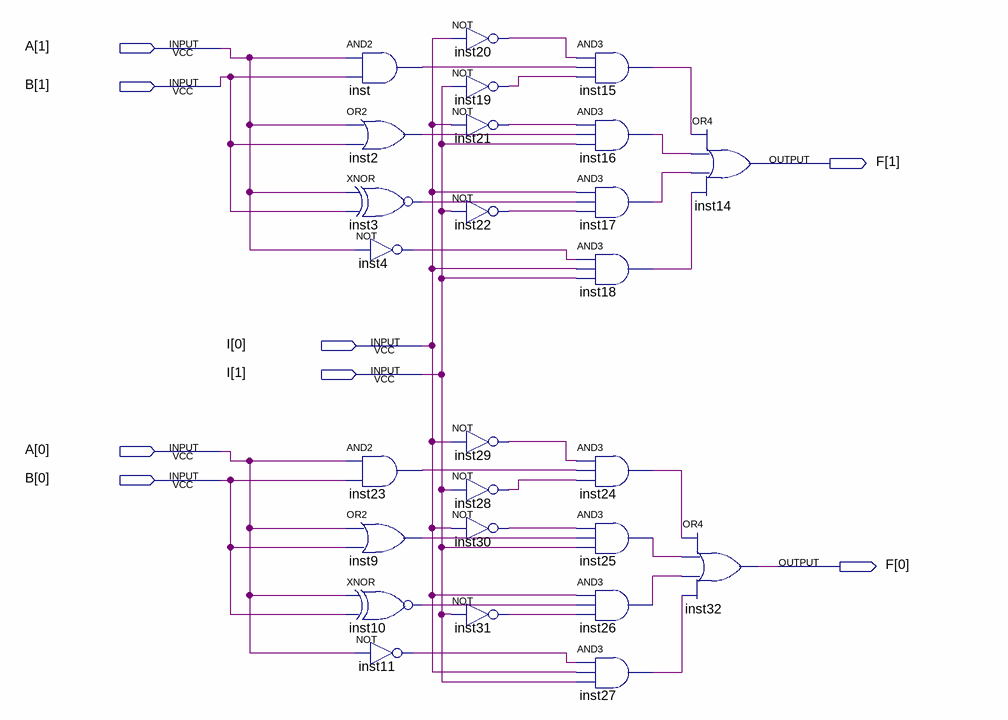
[diagram p0: schematic sheet]
// Quartus schematic TinyTechSchem.bdf as structural Verilog: 26 symbols, 8 pins
module TinyTechSchem (
  input  [1:0] A,
  input  [1:0] B,
  input  [1:0] I,
  output [1:0] F
);

  wire inst2_out, inst3_out, inst4_out, inst9_out, inst10_out, inst11_out, inst15_out, inst16_out,
       inst17_out, inst18_out, inst19_out, inst20_out, inst21_out, inst22_out, inst23_out, inst24_out,
       inst25_out, inst26_out, inst27_out, inst28_out, inst29_out, inst30_out, inst31_out, inst_out;

  and inst (inst_out, A[1], B[1]);
  or inst2 (inst2_out, A[1], B[1]);
  xnor inst3 (inst3_out, A[1], B[1]);
  not inst4 (inst4_out, A[1]);
  and inst23 (inst23_out, A[0], B[0]);
  or inst9 (inst9_out, A[0], B[0]);
  xnor inst10 (inst10_out, A[0], B[0]);
  not inst11 (inst11_out, A[0]);
  not inst20 (inst20_out, I[0]);
  not inst19 (inst19_out, I[1]);
  not inst21 (inst21_out, I[0]);
  not inst22 (inst22_out, I[1]);
  not inst29 (inst29_out, I[0]);
  not inst28 (inst28_out, I[1]);
  not inst30 (inst30_out, I[0]);
  not inst31 (inst31_out, I[1]);
  and inst15 (inst15_out, inst20_out, inst_out, inst19_out);
  and inst16 (inst16_out, inst21_out, inst2_out, I[1]);
  and inst17 (inst17_out, I[0], inst3_out, inst22_out);
  and inst18 (inst18_out, inst4_out, I[0], I[1]);
  and inst24 (inst24_out, inst29_out, inst23_out, inst28_out);
  and inst25 (inst25_out, inst30_out, inst9_out, I[1]);
  and inst26 (inst26_out, I[0], inst10_out, inst31_out);
  and inst27 (inst27_out, inst11_out, I[0], I[1]);
  or inst14 (F[1], inst15_out, inst16_out, inst17_out, inst18_out);
  or inst32 (F[0], inst24_out, inst25_out, inst26_out, inst27_out);
endmodule
